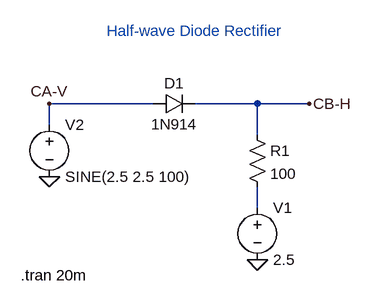
[diagram p0: schematic half_wave_diode_rectifier_bb.asc]
half_wave_diode_rectifier_bb.asc, the LTspice schematic file:
Version 4
SHEET 1 880 680
WIRE 96 144 -64 144
WIRE 256 144 160 144
WIRE 336 144 256 144
WIRE -64 176 -64 144
WIRE 256 192 256 144
WIRE 256 304 256 272
FLAG 336 144 CB-H
FLAG -64 144 CA-V
FLAG 256 384 0
FLAG -64 256 0
SYMBOL diode 96 160 R270
WINDOW 0 32 32 VTop 2
WINDOW 3 0 32 VBottom 2
SYMATTR InstName D1
SYMATTR Value 1N914
SYMBOL res 240 176 R0
SYMATTR InstName R1
SYMATTR Value 100
SYMBOL voltage 256 288 R0
SYMATTR InstName V1
SYMATTR Value 2.5
SYMBOL voltage -64 160 R0
WINDOW 123 0 0 Left 0
WINDOW 39 0 0 Left 0
SYMATTR InstName V2
SYMATTR Value SINE(2.5 2.5 100)
TEXT 24 32 Left 2 ;Half-wave Diode Rectifier
TEXT -108 408 Left 2 !.tran 20m

The netlist it stands for:
* half_wave_diode_rectifier_bb.asc
D1 CA-V CB-H 1N914
R1 CB-H N001 100
V1 N001 0 2.5
V2 CA-V 0 SINE(2.5 2.5 100)
.model D D
.lib standard.dio
* Half-wave Diode Rectifier
.tran 20m
.backanno
.end